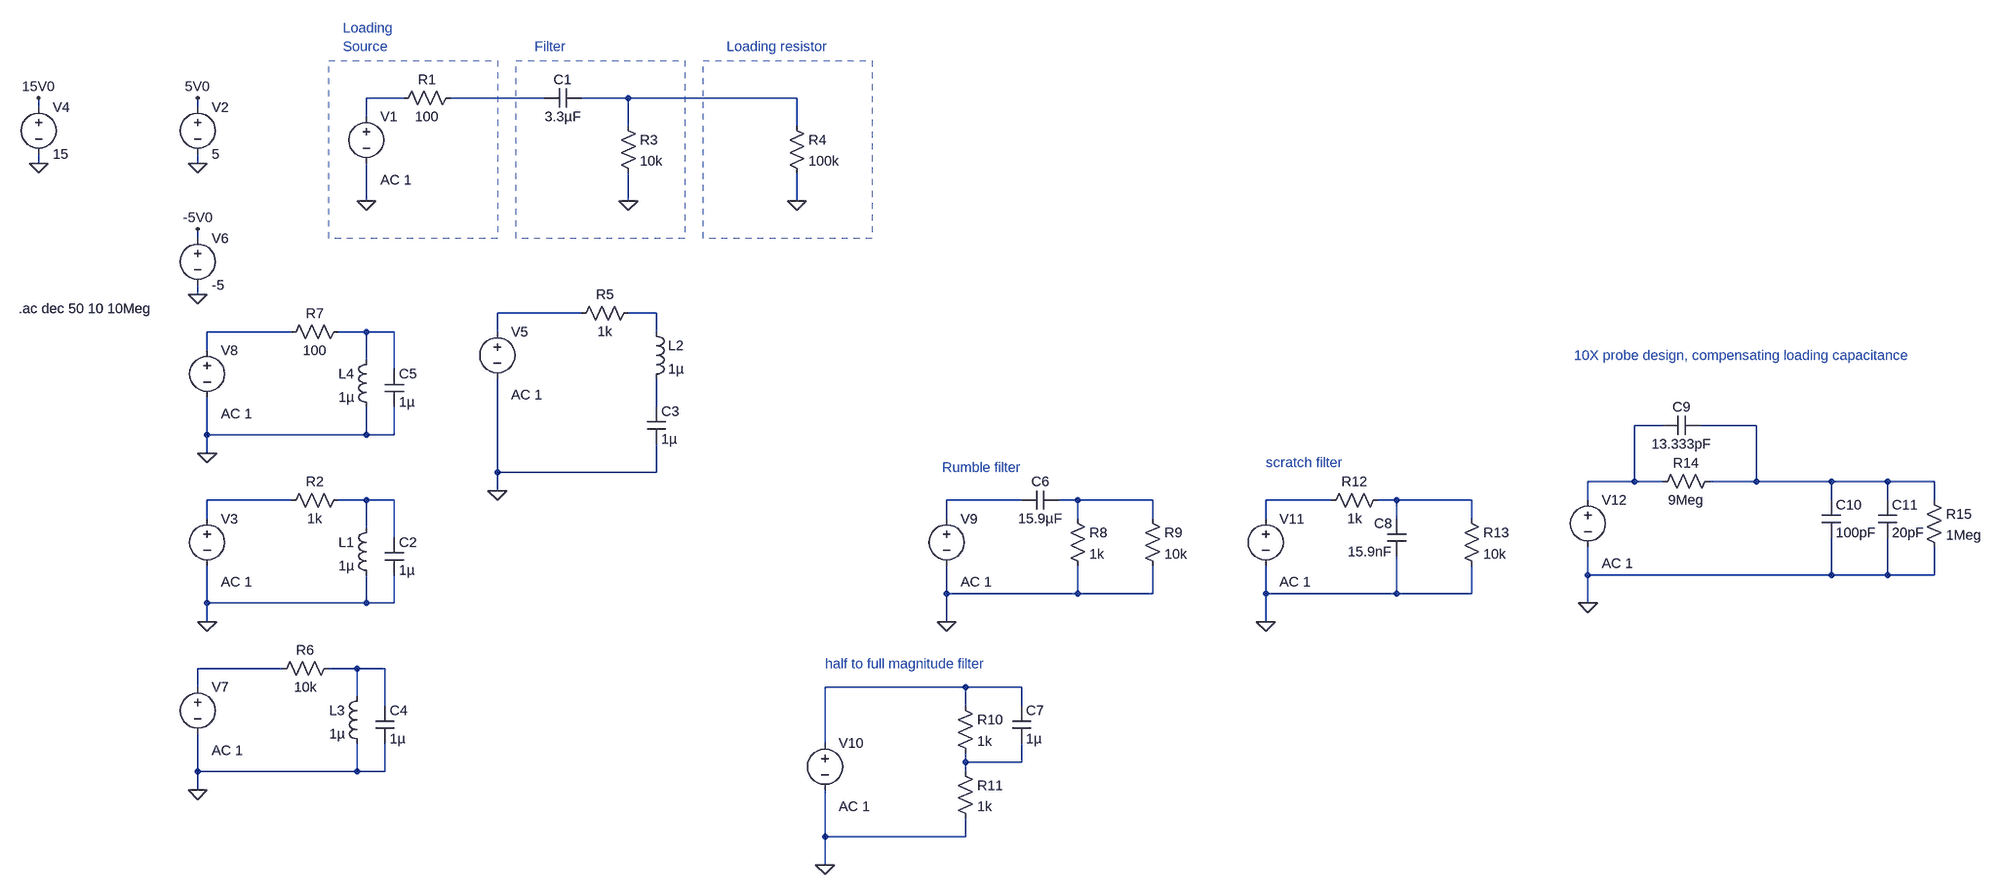
[diagram p0: schematic filters.asc]
filters.asc, the LTspice schematic file:
Version 4
SHEET 1 3572 1700
WIRE 16 368 -48 368
WIRE 256 368 96 368
WIRE 400 368 320 368
WIRE 688 368 400 368
WIRE -608 384 -608 368
WIRE -336 384 -336 368
WIRE -48 400 -48 368
WIRE 400 416 400 368
WIRE 688 416 688 368
WIRE -608 480 -608 464
WIRE -336 480 -336 464
WIRE -48 544 -48 480
WIRE 400 544 400 496
WIRE 688 544 688 496
WIRE -336 608 -336 592
WIRE -336 704 -336 688
WIRE 320 736 176 736
WIRE 448 736 400 736
WIRE -176 768 -320 768
WIRE -48 768 -96 768
WIRE 0 768 -48 768
WIRE 176 768 176 736
WIRE 448 768 448 736
WIRE -320 800 -320 768
WIRE -48 816 -48 768
WIRE 0 832 0 768
WIRE 448 896 448 848
WIRE 2928 928 2880 928
WIRE 3088 928 2992 928
WIRE -320 944 -320 880
WIRE -48 944 -48 896
WIRE -48 944 -320 944
WIRE 0 944 0 896
WIRE 0 944 -48 944
WIRE -320 976 -320 944
WIRE 176 1008 176 848
WIRE 448 1008 448 960
WIRE 448 1008 176 1008
WIRE 2880 1024 2880 928
WIRE 2880 1024 2800 1024
WIRE 2928 1024 2880 1024
WIRE 3088 1024 3088 928
WIRE 3088 1024 3008 1024
WIRE 3216 1024 3088 1024
WIRE 3312 1024 3216 1024
WIRE 3392 1024 3312 1024
WIRE 176 1040 176 1008
WIRE -176 1056 -320 1056
WIRE -48 1056 -96 1056
WIRE 0 1056 -48 1056
WIRE 1072 1056 944 1056
WIRE 1168 1056 1136 1056
WIRE 1296 1056 1168 1056
WIRE 1888 1056 1776 1056
WIRE 2000 1056 1968 1056
WIRE 2128 1056 2000 1056
WIRE 2800 1056 2800 1024
WIRE 3216 1056 3216 1024
WIRE 3312 1056 3312 1024
WIRE 3392 1056 3392 1024
WIRE -320 1088 -320 1056
WIRE 944 1088 944 1056
WIRE 1168 1088 1168 1056
WIRE 1296 1088 1296 1056
WIRE 1776 1088 1776 1056
WIRE 2000 1088 2000 1056
WIRE 2128 1088 2128 1056
WIRE -48 1104 -48 1056
WIRE 0 1120 0 1056
WIRE 2800 1184 2800 1136
WIRE 3216 1184 3216 1120
WIRE 3216 1184 2800 1184
WIRE 3312 1184 3312 1120
WIRE 3312 1184 3216 1184
WIRE 3392 1184 3392 1136
WIRE 3392 1184 3312 1184
WIRE 944 1216 944 1168
WIRE 1168 1216 1168 1168
WIRE 1168 1216 944 1216
WIRE 1296 1216 1296 1168
WIRE 1296 1216 1168 1216
WIRE 1776 1216 1776 1168
WIRE 2000 1216 2000 1152
WIRE 2000 1216 1776 1216
WIRE 2128 1216 2128 1168
WIRE 2128 1216 2000 1216
WIRE -320 1232 -320 1168
WIRE -48 1232 -48 1184
WIRE -48 1232 -320 1232
WIRE 0 1232 0 1184
WIRE 0 1232 -48 1232
WIRE 2800 1232 2800 1184
WIRE -320 1264 -320 1232
WIRE 944 1264 944 1216
WIRE 1776 1264 1776 1216
WIRE -192 1344 -336 1344
WIRE -64 1344 -112 1344
WIRE -16 1344 -64 1344
WIRE -336 1376 -336 1344
WIRE 976 1376 736 1376
WIRE 1072 1376 976 1376
WIRE -64 1392 -64 1344
WIRE -16 1408 -16 1344
WIRE 976 1408 976 1376
WIRE 1072 1408 1072 1376
WIRE 736 1472 736 1376
WIRE 976 1504 976 1488
WIRE 1072 1504 1072 1472
WIRE 1072 1504 976 1504
WIRE -336 1520 -336 1456
WIRE -64 1520 -64 1472
WIRE -64 1520 -336 1520
WIRE -16 1520 -16 1472
WIRE -16 1520 -64 1520
WIRE 976 1520 976 1504
WIRE -336 1552 -336 1520
WIRE 736 1632 736 1552
WIRE 976 1632 976 1600
WIRE 976 1632 736 1632
WIRE 736 1680 736 1632
FLAG -336 480 0
FLAG -336 368 5V0
FLAG -608 480 0
FLAG -608 368 15V0
FLAG -336 704 0
FLAG -336 592 -5V0
FLAG -48 544 0
FLAG 400 544 0
FLAG 688 544 0
FLAG -320 1264 0
FLAG 176 1040 0
FLAG -336 1552 0
FLAG -320 976 0
FLAG 944 1264 0
FLAG 736 1680 0
FLAG 1776 1264 0
FLAG 2800 1232 0
SYMBOL voltage -336 368 R0
WINDOW 123 0 0 Left 0
WINDOW 39 0 0 Left 0
SYMATTR InstName V2
SYMATTR Value 5
SYMBOL voltage -608 368 R0
WINDOW 123 0 0 Left 0
WINDOW 39 0 0 Left 0
SYMATTR InstName V4
SYMATTR Value 15
SYMBOL voltage -336 592 R0
WINDOW 123 0 0 Left 0
WINDOW 39 0 0 Left 0
SYMATTR InstName V6
SYMATTR Value -5
SYMBOL voltage -48 384 R0
WINDOW 123 24 124 Left 2
WINDOW 39 0 0 Left 0
SYMATTR InstName V1
SYMATTR Value ""
SYMATTR Value2 AC 1
SYMBOL res 112 352 R90
WINDOW 0 0 56 VBottom 2
WINDOW 3 32 56 VTop 2
SYMATTR InstName R1
SYMATTR Value 100
SYMBOL res 384 400 R0
SYMATTR InstName R3
SYMATTR Value 10k
SYMBOL res 672 400 R0
SYMATTR InstName R4
SYMATTR Value 100k
SYMBOL cap 320 352 R90
WINDOW 0 0 32 VBottom 2
WINDOW 3 32 32 VTop 2
SYMATTR InstName C1
SYMATTR Value 3.3µF
SYMBOL res -80 1040 R90
WINDOW 0 0 56 VBottom 2
WINDOW 3 32 56 VTop 2
SYMATTR InstName R2
SYMATTR Value 1k
SYMBOL cap -16 1120 R0
SYMATTR InstName C2
SYMATTR Value 1µ
SYMBOL ind -32 1088 M0
SYMATTR InstName L1
SYMATTR Value 1µ
SYMBOL voltage -320 1072 R0
WINDOW 123 24 124 Left 2
WINDOW 39 0 0 Left 0
SYMATTR InstName V3
SYMATTR Value ""
SYMATTR Value2 AC 1
SYMBOL res 416 720 R90
WINDOW 0 0 56 VBottom 2
WINDOW 3 32 56 VTop 2
SYMATTR InstName R5
SYMATTR Value 1k
SYMBOL cap 432 896 R0
SYMATTR InstName C3
SYMATTR Value 1µ
SYMBOL ind 432 752 R0
SYMATTR InstName L2
SYMATTR Value 1µ
SYMBOL voltage 176 752 R0
WINDOW 123 24 124 Left 2
WINDOW 39 0 0 Left 0
SYMATTR InstName V5
SYMATTR Value ""
SYMATTR Value2 AC 1
SYMBOL res -96 1328 R90
WINDOW 0 0 56 VBottom 2
WINDOW 3 32 56 VTop 2
SYMATTR InstName R6
SYMATTR Value 10k
SYMBOL cap -32 1408 R0
SYMATTR InstName C4
SYMATTR Value 1µ
SYMBOL ind -48 1376 M0
SYMATTR InstName L3
SYMATTR Value 1µ
SYMBOL voltage -336 1360 R0
WINDOW 123 24 124 Left 2
WINDOW 39 0 0 Left 0
SYMATTR InstName V7
SYMATTR Value ""
SYMATTR Value2 AC 1
SYMBOL res -80 752 R90
WINDOW 0 0 56 VBottom 2
WINDOW 3 32 56 VTop 2
SYMATTR InstName R7
SYMATTR Value 100
SYMBOL cap -16 832 R0
SYMATTR InstName C5
SYMATTR Value 1µ
SYMBOL ind -32 800 M0
SYMATTR InstName L4
SYMATTR Value 1µ
SYMBOL voltage -320 784 R0
WINDOW 123 24 124 Left 2
WINDOW 39 0 0 Left 0
SYMATTR InstName V8
SYMATTR Value ""
SYMATTR Value2 AC 1
SYMBOL voltage 944 1072 R0
WINDOW 123 24 124 Left 2
WINDOW 39 0 0 Left 0
SYMATTR InstName V9
SYMATTR Value ""
SYMATTR Value2 AC 1
SYMBOL cap 1136 1040 R90
WINDOW 0 0 32 VBottom 2
WINDOW 3 32 32 VTop 2
SYMATTR InstName C6
SYMATTR Value 15.9µF
SYMBOL res 1152 1072 R0
SYMATTR InstName R8
SYMATTR Value 1k
SYMBOL res 1280 1072 R0
SYMATTR InstName R9
SYMATTR Value 10k
SYMBOL voltage 736 1456 R0
WINDOW 123 24 124 Left 2
WINDOW 39 0 0 Left 0
SYMATTR InstName V10
SYMATTR Value ""
SYMATTR Value2 AC 1
SYMBOL res 960 1392 R0
SYMATTR InstName R10
SYMATTR Value 1k
SYMBOL res 960 1504 R0
SYMATTR InstName R11
SYMATTR Value 1k
SYMBOL cap 1056 1408 R0
SYMATTR InstName C7
SYMATTR Value 1µ
SYMBOL voltage 1776 1072 R0
WINDOW 123 24 124 Left 2
WINDOW 39 0 0 Left 0
SYMATTR InstName V11
SYMATTR Value ""
SYMATTR Value2 AC 1
SYMBOL cap 2016 1152 R180
WINDOW 0 24 56 Left 2
WINDOW 3 24 8 Left 2
SYMATTR InstName C8
SYMATTR Value 15.9nF
SYMBOL res 1984 1040 R90
WINDOW 0 0 56 VBottom 2
WINDOW 3 32 56 VTop 2
SYMATTR InstName R12
SYMATTR Value 1k
SYMBOL res 2112 1072 R0
SYMATTR InstName R13
SYMATTR Value 10k
SYMBOL voltage 2800 1040 R0
WINDOW 123 24 124 Left 2
WINDOW 39 0 0 Left 0
SYMATTR InstName V12
SYMATTR Value ""
SYMATTR Value2 AC 1
SYMBOL res 3024 1008 R90
WINDOW 0 0 56 VBottom 2
WINDOW 3 32 56 VTop 2
SYMATTR InstName R14
SYMATTR Value 9Meg
SYMBOL cap 2992 912 R90
WINDOW 0 0 32 VBottom 2
WINDOW 3 32 32 VTop 2
SYMATTR InstName C9
SYMATTR Value 13.333pF
SYMBOL cap 3200 1056 R0
SYMATTR InstName C10
SYMATTR Value 100pF
SYMBOL res 3376 1040 R0
SYMATTR InstName R15
SYMATTR Value 1Meg
SYMBOL cap 3296 1056 R0
SYMATTR InstName C11
SYMATTR Value 20pF
TEXT -88 248 Left 2 ;Loading
TEXT -642 728 Left 2 !.ac dec 50 10 10Meg
TEXT -88 280 Left 2 ;Source
TEXT 240 280 Left 2 ;Filter
TEXT 568 280 Left 2 ;Loading resistor
TEXT 936 1000 Left 2 ;Rumble filter
TEXT 1776 992 Left 2 ;scratch filter
TEXT 736 1336 Left 2 ;half to full magnitude filter
TEXT 2776 808 Left 2 ;10X probe design, compensating loading capacitance
RECTANGLE Normal 176 608 -112 304 2
RECTANGLE Normal 496 608 208 304 2
RECTANGLE Normal 816 608 528 304 2

The netlist it stands for:
* filters.asc
V2 5V0 0 5
V4 15V0 0 15
V6 -5V0 0 -5
V1 N001 0 AC 1
R1 N002 N001 100
R3 N003 0 10k
R4 N003 0 100k
C1 N003 N002 3.3µF
R2 N012 N011 1k
C2 N012 0 1µ
L1 N012 0 1µ
V3 N011 0 AC 1
R5 N005 N004 1k
C3 N008 0 1µ
L2 N005 N008 1µ
V5 N004 0 AC 1
R6 N018 N017 10k
C4 N018 0 1µ
L3 N018 0 1µ
V7 N017 0 AC 1
R7 N007 N006 100
C5 N007 0 1µ
L4 N007 0 1µ
V8 N006 0 AC 1
V9 N013 0 AC 1
C6 N014 N013 15.9µF
R8 N014 0 1k
R9 N014 0 10k
V10 N019 0 AC 1
R10 N019 N020 1k
R11 N020 0 1k
C7 N019 N020 1µ
V11 N015 0 AC 1
C8 0 N016 15.9nF
R12 N016 N015 1k
R13 N016 0 10k
V12 N009 0 AC 1
R14 N010 N009 9Meg
C9 N010 N009 13.333pF
C10 N010 0 100pF
R15 N010 0 1Meg
C11 N010 0 20pF
* Loading
.ac dec 50 10 10Meg
* Source
* Filter
* Loading resistor
* Rumble filter
* scratch filter
* half to full magnitude filter
* 10X probe design, compensating loading capacitance
.backanno
.end